# Altium project WaterSupplyController.PrjPcb
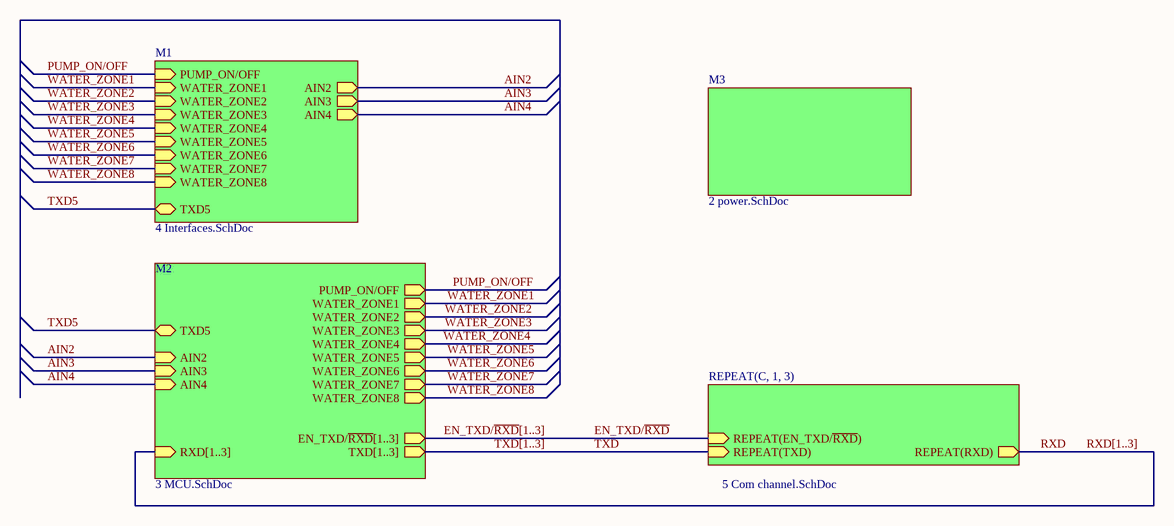
[diagram p0: 1 top level sheet.SchDoc]
GlobalOrganizationName: Элсидан; GlobalProjectName: Контроллер водоснабжения; GlobalProjectNumber: 123456.123; GlobalProjectRevision: 1; PCB_ID: 2022
5 sheets, 176 parts. Net scope: hierarchical (ports join the sheet entries above them; power ports are global).
Board file: WaterSupplyController.PcbDoc
Sheets:
  1 top level sheet.SchDoc
    M3 = 2 power.SchDoc
    M1 = 4 Interfaces.SchDoc
    M2 = 3 MCU.SchDoc
    C1 = 5 Com channel.SchDoc
    C2 = 5 Com channel.SchDoc
    C3 = 5 Com channel.SchDoc

## Sheet 1 top level sheet.SchDoc
size A3; Organization: Altium Limited; Address1: L3, 12a Rodborough Rd; Address2: Frenchs Forest; Address3: NSW; Address4: Australia 2086; DocumentNumber: 1; SheetNumber: 1; SheetTotal: 5

### Sub-sheets
M1 = 4 Interfaces.SchDoc: WATER_ZONE3 (in), WATER_ZONE1 (in), WATER_ZONE2 (in), AIN3 (out), WATER_ZONE5 (in), AIN2 (out), WATER_ZONE8 (in), WATER_ZONE7 (in), AIN4 (out), WATER_ZONE6 (in), PUMP_ON/OFF (in), WATER_ZONE4 (in), TXD5 (bidir)
M2 = 3 MCU.SchDoc: PUMP_ON/OFF (out), WATER_ZONE1 (out), WATER_ZONE2 (out), WATER_ZONE3 (out), WATER_ZONE4 (out), WATER_ZONE5 (out), RXD[1..3] (in), TXD[1..3] (out), EN_TXD/~{RXD}[1..3] (out), WATER_ZONE8 (out), WATER_ZONE6 (out), WATER_ZONE7 (out), AIN3 (in), AIN2 (in), TXD5 (bidir), AIN4 (in)
M3 = 2 power.SchDoc: no entries
REPEAT(C, 1, 3) = 5 Com channel.SchDoc: REPEAT(RXD) (out), REPEAT(TXD) (in), REPEAT(EN_TXD/~{RXD}) (in)

### Nets
AIN2: sheet M1/AIN2, sheet M2/AIN2
AIN3: sheet M1/AIN3, sheet M2/AIN3
AIN4: sheet M1/AIN4, sheet M2/AIN4
EN_TXD/~{RXD}: sheet REPEAT(C, 1, 3)/REPEAT(EN_TXD/~{RXD})
PUMP_ON/OFF: sheet M1/PUMP_ON/OFF, sheet M2/PUMP_ON/OFF
RXD: sheet REPEAT(C, 1, 3)/REPEAT(RXD)
TXD: sheet REPEAT(C, 1, 3)/REPEAT(TXD)
TXD5: sheet M1/TXD5, sheet M2/TXD5
WATER_ZONE1: sheet M1/WATER_ZONE1, sheet M2/WATER_ZONE1
WATER_ZONE2: sheet M1/WATER_ZONE2, sheet M2/WATER_ZONE2
WATER_ZONE3: sheet M1/WATER_ZONE3, sheet M2/WATER_ZONE3
WATER_ZONE4: sheet M1/WATER_ZONE4, sheet M2/WATER_ZONE4
WATER_ZONE5: sheet M1/WATER_ZONE5, sheet M2/WATER_ZONE5
WATER_ZONE6: sheet M1/WATER_ZONE6, sheet M2/WATER_ZONE6
WATER_ZONE7: sheet M1/WATER_ZONE7, sheet M2/WATER_ZONE7
WATER_ZONE8: sheet M1/WATER_ZONE8, sheet M2/WATER_ZONE8

### Buses and harness runs
bus EN_TXD/~{RXD}[1..3] = sheet M2/EN_TXD/~{RXD}[1..3]
bus RXD[1..3] = sheet M2/RXD[1..3]
bus TXD[1..3] = sheet M2/TXD[1..3]

### Notes on the sheet
- Title
- Size:
- Date:
- A3
- Number:
- Time:
- Revision:
- Sheet
- of
- File:

## Sheet 2 power.SchDoc: =GlobalProjectName
size A4; CompanyName: Элсидан; Organization: Элсидан; DocumentNumber: 2; Revision: 1; SheetNumber: 2; SheetTotal: 5; PageSetup: Record=PageOptions|CenterHorizontal=True|CenterVertical=True|PrintScale=1.00|XCorrection=1.00|YCorrection=1.00|PrintKind=1|BorderSize=5000000|LeftOffset=0|BottomOffset=0|Orientation=2|PaperLength=1000|PaperWidth=1000|Scale=100|PaperSource=15|PrintQuality=1200|MediaType=1|DitherType=10|PaperKind=A3|PrintScaleMode=1; Weight: -; ScaleFactor: -; FirstApplication: 123456.123
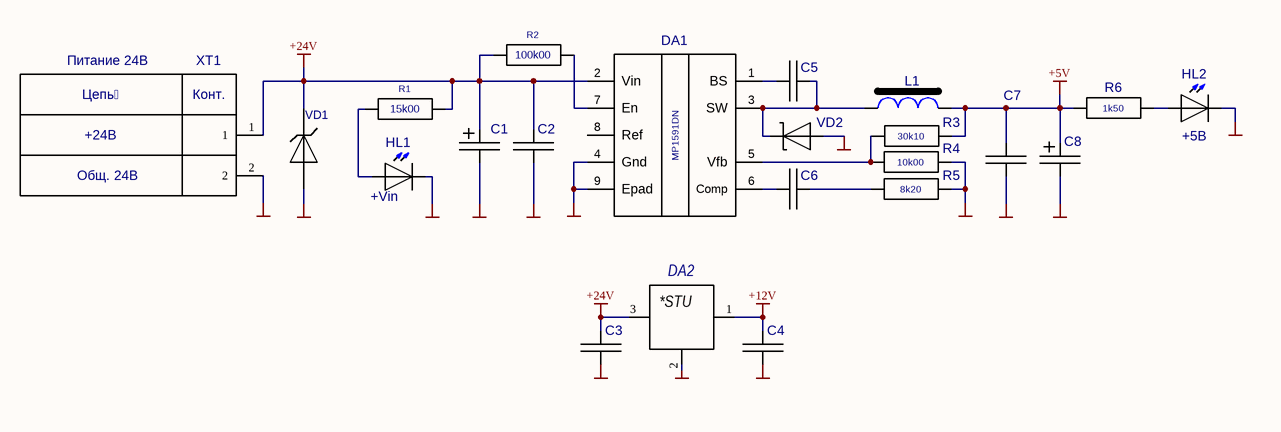
[diagram p1: 2 power.SchDoc]

### Parts
C1  22.0x35V  [TC7343-D]  (value not drawn)
C2  C0603  [0603_CAP]  (value not drawn)
C3  C0603  [0603_CAP]  (value not drawn)
C4  C0603  [0603_CAP]  (value not drawn)
C5  C0603  [0603_CAP]  (value not drawn)
C6  C0603  [0603_CAP]  (value not drawn)
C7  C0603  [0603_CAP]  (value not drawn)
C8  100.0x16V  [TC7343-D]  (value not drawn)
DA1  MP1591DN  [HSOP8]
DA2  L78L12ABUTR  [SOT-89]  (value not drawn)
HL1  KP-2012SYC  [KP-2012_YEL]  (value not drawn)
HL2  KP-2012MGC  [KP-2012_GRN]  (value not drawn)
L1  22µH CDRH124NP-220MC  [CDRH124]  (value not drawn)
R1  15k00  [0603_RES]
R2  100k00  [0603_RES]
R3  value 30k10  [0603_RES]  (hidden comment: R0603)
R4  value 10k00  [0603_RES]  (hidden comment: R0603)
R5  value 8k20  [0603_RES]  (hidden comment: R0603)
R6  value 1k50  [0603_RES]  (hidden comment: R0603)
VD1  P1.5KE24A  [DO-201AD]  (value not drawn)
VD2  STPS3L60U  [SMB-STPS3L60U]  (value not drawn)
XT1  XY301VA-5.0-2P-12  [301-021-12]  (value not drawn)  (parts A,B of 2)

### Nets
+5V: C7.1 C8.1 L1.2 R3.2 R6.1
+12V: C4.1 DA2.1(Out)
+24V: C1.1 C2.1 C3.1 DA1.2(Vin) DA2.3(In) R1.2 R2.1 VD1.2(C) XT1.1
GND: C1.2 C2.2 C3.2 C4.2 C7.2 C8.2 DA1.4(Gnd) DA1.9(Epad) DA2.2(GND) HL1.2(K) HL2.2(K) R4.2 R5.2 VD1.1(A) VD2.1(A) XT1.2
NetC5_1: C5.1 DA1.1(BS)
NetC5_2: C5.2 DA1.3(SW) L1.1 VD2.2(K)
NetC6_1: C6.1 DA1.6(Comp)
NetC6_2: C6.2 R5.1
NetDA1_5: DA1.5(Vfb) R3.1 R4.1
NetDA1_7: DA1.7(En) R2.2
NetHL1_1: HL1.1(A) R1.1
NetHL2_1: HL2.1(A) R6.2

Not connected (* = marked no-connect by the designer): DA1 8(Ref)

### Notes on the sheet
- Питание 24В
- XT1
- +24B
- Цепь
- (near XT1) Конт.
- (near HL2) +5В
- Общ. 24B
- (near HL1) +Vin
- Title
- Size:
- Date:
- A4
- Number:
- Time:
- Revision:
- Sheet
- of
- File:
- (in symbol L78L12ABUTR) *STU

### Library data of the parts
C1 = TC6032-D: Value: 22.0x35V
C2-C4 C7 = C0603: Value: µ10x50V X7R
C5 = C0603: Value: 10nFx50V X7R
C6 = C0603: Value: 1n8x50V X7R
C8 = TC7343-D: Value: 100.0x16V
DA2 = L78L12ABUTR: ID: 19; Input Voltage: +8.5…30V; Output Current: 100mA; Output Voltage: +12V; RMS Noise: 40uV; Temperature Stability: ±4%; Line Regulation: 200mV; Value: L78L12ABUTR; Published: 13.08.2015; Publisher: Andrew Danich; Type: Микросхема; Part Number: L78L12ABUTR
HL1 HL2 = KP-2012
  HL1: Value: KP-2012SYC
  HL2: Value: KP-2012MGC
L1 = CDRH124: Value: 22µH CDRH124NP-220MC
R1 R2 = R0603
  R1: Value: 15k00
  R2: Value: 100k00
VD1 = P1.5KE_X_(A): Value: P1.5KE24A
XT1 = 301-021-12: Клеммник винтовой, 2-контактный, 5мм, прямой; Value: XY301VA-5.0-2P-12
DA1 = MP1591DN: Value: MP1591DN
VD2 = STPS3L60U: Value: STPS3L60U

## Sheet 4 Interfaces.SchDoc
size A3 portrait; Organization: Altium Limited; Address1: L3, 12a Rodborough Rd; Address2: Frenchs Forest; Address3: NSW; Address4: Australia 2086; DocumentNumber: 4; SheetNumber: 4; SheetTotal: 5; PageSetup: Record=PageOptions|CenterHorizontal=True|CenterVertical=True|PrintScale=1.00|XCorrection=1.00|YCorrection=1.00|PrintKind=1|BorderSize=5000000|LeftOffset=0|BottomOffset=0|Orientation=2|PaperLength=1000|PaperWidth=1000|Scale=100|PaperSource=15|PrintQuality=1200|MediaType=1|DitherType=10|PaperKind=A3|PrintScaleMode=1; Weight: -; ScaleFactor: -; NormInspection: Норм.Контр.; FirstApplication: 123456.123
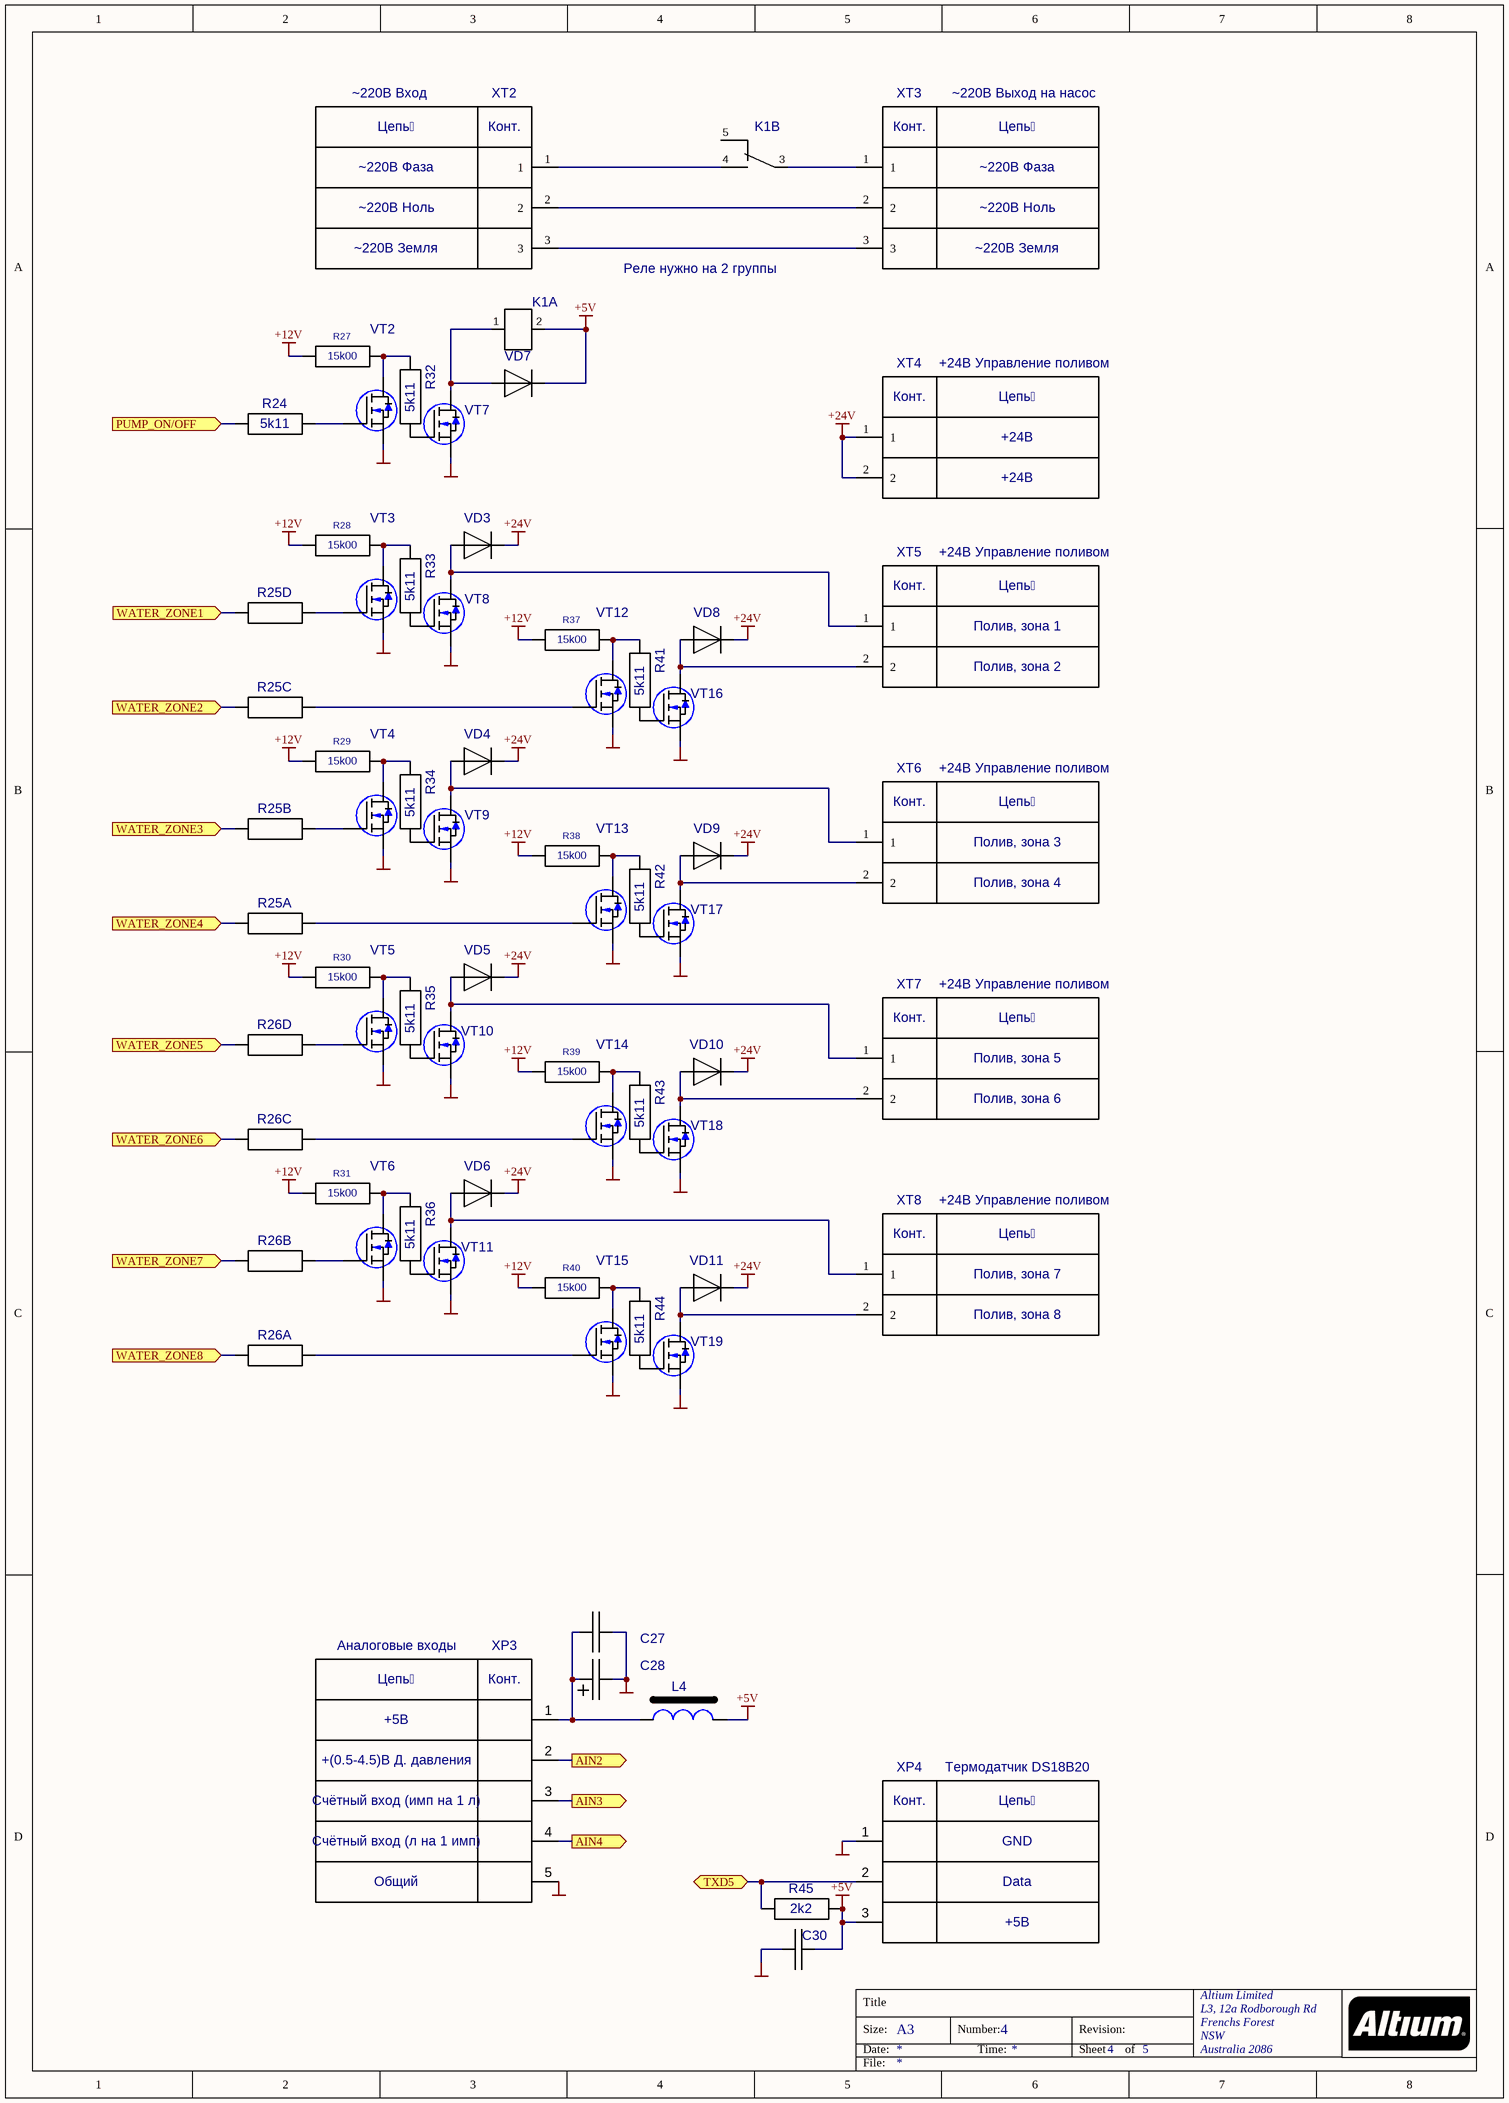
[diagram p2: 4 Interfaces.SchDoc]

### Parts
C27  C0402  [0402_CAP]  (value not drawn)
C28  10.0x16V  [TC3216-A]  (value not drawn)
C30  C0402  [0402_CAP]  (value not drawn)
K1  TRV-5VDC-SC-CD  [TRV-5VDC-SC-CD]  (value not drawn)  (parts A,B of 2)
L4  100µH LQH43CN101K  [LQH43]  (value not drawn)
R24  5k11  [0603_RES]
R25  4k7 CAT16-472J4  [CAT16]  (value not drawn)  (parts A,B,C,D of 4)
R26  4k7 CAT16-472J4  [CAT16]  (value not drawn)  (parts A,B,C,D of 4)
R27  15k00  [0603_RES]
R28  15k00  [0603_RES]
R29  15k00  [0603_RES]
R30  15k00  [0603_RES]
R31  15k00  [0603_RES]
R32  5k11  [0603_RES]
R33  5k11  [0603_RES]
R34  5k11  [0603_RES]
R35  5k11  [0603_RES]
R36  5k11  [0603_RES]
R37  15k00  [0603_RES]
R38  15k00  [0603_RES]
R39  15k00  [0603_RES]
R40  15k00  [0603_RES]
R41  5k11  [0603_RES]
R42  5k11  [0603_RES]
R43  5k11  [0603_RES]
R44  5k11  [0603_RES]
R45  2k2  [0603_RES]
VD3  ES1D  [SMA]  (value not drawn)
VD4  ES1D  [SMA]  (value not drawn)
VD5  ES1D  [SMA]  (value not drawn)
VD6  ES1D  [SMA]  (value not drawn)
VD7  ES1D  [SMA]  (value not drawn)
VD8  ES1D  [SMA]  (value not drawn)
VD9  ES1D  [SMA]  (value not drawn)
VD10  ES1D  [SMA]  (value not drawn)
VD11  ES1D  [SMA]  (value not drawn)
VT2  MMBF170Q-7-F  [SOT-23 MOSFET]  (value not drawn)
VT3  MMBF170Q-7-F  [SOT-23 MOSFET]  (value not drawn)
VT4  MMBF170Q-7-F  [SOT-23 MOSFET]  (value not drawn)
VT5  MMBF170Q-7-F  [SOT-23 MOSFET]  (value not drawn)
VT6  MMBF170Q-7-F  [SOT-23 MOSFET]  (value not drawn)
VT7  AO3400A  [SOT-23 MOSFET]  (value not drawn)
VT8  AO3400A  [SOT-23 MOSFET]  (value not drawn)
VT9  AO3400A  [SOT-23 MOSFET]  (value not drawn)
VT10  AO3400A  [SOT-23 MOSFET]  (value not drawn)
VT11  AO3400A  [SOT-23 MOSFET]  (value not drawn)
VT12  MMBF170Q-7-F  [SOT-23 MOSFET]  (value not drawn)
VT13  MMBF170Q-7-F  [SOT-23 MOSFET]  (value not drawn)
VT14  MMBF170Q-7-F  [SOT-23 MOSFET]  (value not drawn)
VT15  MMBF170Q-7-F  [SOT-23 MOSFET]  (value not drawn)
VT16  AO3400A  [SOT-23 MOSFET]  (value not drawn)
VT17  AO3400A  [SOT-23 MOSFET]  (value not drawn)
VT18  AO3400A  [SOT-23 MOSFET]  (value not drawn)
VT19  AO3400A  [SOT-23 MOSFET]  (value not drawn)
XP3  PH-5  [PH-5]  (value not drawn)  (parts A,B,C,D,E of 5)
XP4  PH-3  [PH-3]  (value not drawn)  (parts A,B,C of 3)
XT2  XY301VA-5.0-3P-12  [301-031-12]  (value not drawn)  (parts A,B,C of 3)
XT3  XY301VA-5.0-3P-12  [301-031-12]  (value not drawn)  (parts A,B,C of 3)
XT4  XY301VA-5.0-2P-12  [301-021-12]  (value not drawn)  (parts A,B of 2)
XT5  XY301VA-5.0-2P-12  [301-021-12]  (value not drawn)  (parts A,B of 2)
XT6  XY301VA-5.0-2P-12  [301-021-12]  (value not drawn)  (parts A,B of 2)
XT7  XY301VA-5.0-2P-12  [301-021-12]  (value not drawn)  (parts A,B of 2)
XT8  XY301VA-5.0-2P-12  [301-021-12]  (value not drawn)  (parts A,B of 2)

### Ports
AIN2 (out), AIN3 (out), AIN4 (out), PUMP_ON/OFF (in), TXD5 (bidir), WATER_ZONE1 (in), WATER_ZONE2 (in), WATER_ZONE3 (in), WATER_ZONE4 (in), WATER_ZONE5 (in), WATER_ZONE6 (in), WATER_ZONE7 (in), WATER_ZONE8 (in)

### Nets
+5V: C30.1 K1.2 L4.2 R45.2 VD7.2(K) XP4.3
+12V: R27.1 R28.1 R29.1 R30.1 R31.1 R37.1 R38.1 R39.1 R40.1
+24V: VD3.2(K) VD4.2(K) VD5.2(K) VD6.2(K) VD8.2(K) VD9.2(K) VD10.2(K) VD11.2(K) XT4.1 XT4.2
GND: C27.2 C28.2 C30.2 VT2.2(S) VT3.2(S) VT4.2(S) VT5.2(S) VT6.2(S) VT7.2(S) VT8.2(S) VT9.2(S) VT10.2(S) VT11.2(S) VT12.2(S) VT13.2(S) VT14.2(S) VT15.2(S) VT16.2(S) VT17.2(S) VT18.2(S) VT19.2(S) XP3.5 XP4.1
AIN2: XP3.2 ; port AIN2
AIN3: XP3.3 ; port AIN3
AIN4: XP3.4 ; port AIN4
PUMP_ON/OFF: R24.1 ; port PUMP_ON/OFF
TXD5: R45.1 XP4.2 ; port TXD5
WATER_ZONE1: R25.7 ; port WATER_ZONE1
WATER_ZONE2: R25.5 ; port WATER_ZONE2
WATER_ZONE3: R25.3 ; port WATER_ZONE3
WATER_ZONE4: R25.1 ; port WATER_ZONE4
WATER_ZONE5: R26.7 ; port WATER_ZONE5
WATER_ZONE6: R26.5 ; port WATER_ZONE6
WATER_ZONE7: R26.3 ; port WATER_ZONE7
WATER_ZONE8: R26.1 ; port WATER_ZONE8
NetC27_1: C27.1 C28.1 L4.1 XP3.1
NetK1_1: K1.1 VD7.1(A) VT7.3(D)
NetK1_3: K1.3 XT3.1
NetK1_4: K1.4 XT2.1
NetR24_2: R24.2 VT2.1(G)
NetR25_2: R25.2 VT13.1(G)
NetR25_4: R25.4 VT4.1(G)
NetR25_6: R25.6 VT12.1(G)
NetR25_8: R25.8 VT3.1(G)
NetR26_2: R26.2 VT15.1(G)
NetR26_4: R26.4 VT6.1(G)
NetR26_6: R26.6 VT14.1(G)
NetR26_8: R26.8 VT5.1(G)
NetR27_2: R27.2 R32.2 VT2.3(D)
NetR28_2: R28.2 R33.2 VT3.3(D)
NetR29_2: R29.2 R34.2 VT4.3(D)
NetR30_2: R30.2 R35.2 VT5.3(D)
NetR31_2: R31.2 R36.2 VT6.3(D)
NetR32_1: R32.1 VT7.1(G)
NetR33_1: R33.1 VT8.1(G)
NetR34_1: R34.1 VT9.1(G)
NetR35_1: R35.1 VT10.1(G)
NetR36_1: R36.1 VT11.1(G)
NetR37_2: R37.2 R41.2 VT12.3(D)
NetR38_2: R38.2 R42.2 VT13.3(D)
NetR39_2: R39.2 R43.2 VT14.3(D)
NetR40_2: R40.2 R44.2 VT15.3(D)
NetR41_1: R41.1 VT16.1(G)
NetR42_1: R42.1 VT17.1(G)
NetR43_1: R43.1 VT18.1(G)
NetR44_1: R44.1 VT19.1(G)
NetVD3_1: VD3.1(A) VT8.3(D) XT5.1
NetVD4_1: VD4.1(A) VT9.3(D) XT6.1
NetVD5_1: VD5.1(A) VT10.3(D) XT7.1
NetVD6_1: VD6.1(A) VT11.3(D) XT8.1
NetVD8_1: VD8.1(A) VT16.3(D) XT5.2
NetVD9_1: VD9.1(A) VT17.3(D) XT6.2
NetVD10_1: VD10.1(A) VT18.3(D) XT7.2
NetVD11_1: VD11.1(A) VT19.3(D) XT8.2
NetXT2_2: XT2.2 XT3.2
NetXT2_3: XT2.3 XT3.3

Not connected (* = marked no-connect by the designer): K1 5

### Notes on the sheet
- ~220В Вход
- XT2
- XT3
- ~220В Выход на насос
- ~220В Фаза
- Цепь
- (near XT2) Конт.
- (near XT3) Конт.
- ~220В Ноль
- ~220В Земля
- Реле нужно на 2 группы
- XT4
- +24В Управление поливом
- (near XT4) Конт.
- +24В
- XT5
- (near XT5) Конт.
- Полив, зона 1
- Полив, зона 2
- XT6
- (near XT6) Конт.
- Полив, зона 3
- Полив, зона 4
- (near XT7) Конт.
- XT7
- Полив, зона 5
- Полив, зона 6
- (near XT8) Конт.
- XT8
- Полив, зона 7
- Полив, зона 8
- Аналоговые входы
- XP3
- +5В
- (near XP3) Конт.
- +(0.5-4.5)В Д. давления
- XP4
- Термодатчик DS18B20
- (near XP3) Счётный вход (л на 1 имп)
- (near XP3) Счётный вход (имп на 1 л)
- (near XP4) Конт.
- GND
- Общий
- Data
- +5B
- Title
- Size:
- Date:
- A3
- Number:
- Time:
- Revision:
- Sheet
- of
- File:

### Library data of the parts
C27 C30 = C0402: Value: µ10x10V X7R
C28 = TC3216-A: Value: 10.0x16V
L4 = LQH43: LQH43, 1812; Value: 100µH LQH43CN101K
R24 R27-R45 = R0603
  R24 R32-R36 R41-R44: Value: 5k11
  R27-R31 R37-R40: Value: 15k00
  R45: Value: 2k2
R25 R26 = CAT16: CAT16-472J4; Value: 4k7 CAT16-472J4
VT2-VT6 VT12-VT15 = MMBF170: Value: MMBF170Q-7-F
VT7-VT11 VT16-VT19 = IRLML2060TRPBF: Value: AO3400A
XP3 = PH-5: Value: B5B-PH-K-S(LF)(SN)
XP4 = PH-3: Value: B3B-PH-K-S(LF)(SN)
XT2 XT3 = 301-031-12: Клеммник винтовой, 3-контактный, 5мм, прямой; Value: XY301VA-5.0-3P-12
XT4-XT8 = 301-021-12: as XT1 on sheet 2 power; Value: XY301VA-5.0-2P-12
K1 = TRV-5VDC-SC-CD: Value: TRV-5VDC-SC-CD
VD3-VD11 = ES1D: Value: ES1D

## Sheet 3 MCU.SchDoc
size A3 portrait; DocumentNumber: 3; SheetNumber: 3; SheetTotal: 5; PageSetup: Record=PageOptions|CenterHorizontal=True|CenterVertical=True|PrintScale=1.00|XCorrection=1.00|YCorrection=1.00|PrintKind=1|BorderSize=5000000|LeftOffset=0|BottomOffset=0|Orientation=2|PaperLength=1000|PaperWidth=1000|Scale=100|PaperSource=15|PrintQuality=1200|MediaType=1|DitherType=10|PaperKind=A3|PrintScaleMode=1; Weight: -; ScaleFactor: -; NormInspection: Норм.Контр.; FirstApplication: 123456.123; DocumentName: Sheet1.SCHDOC
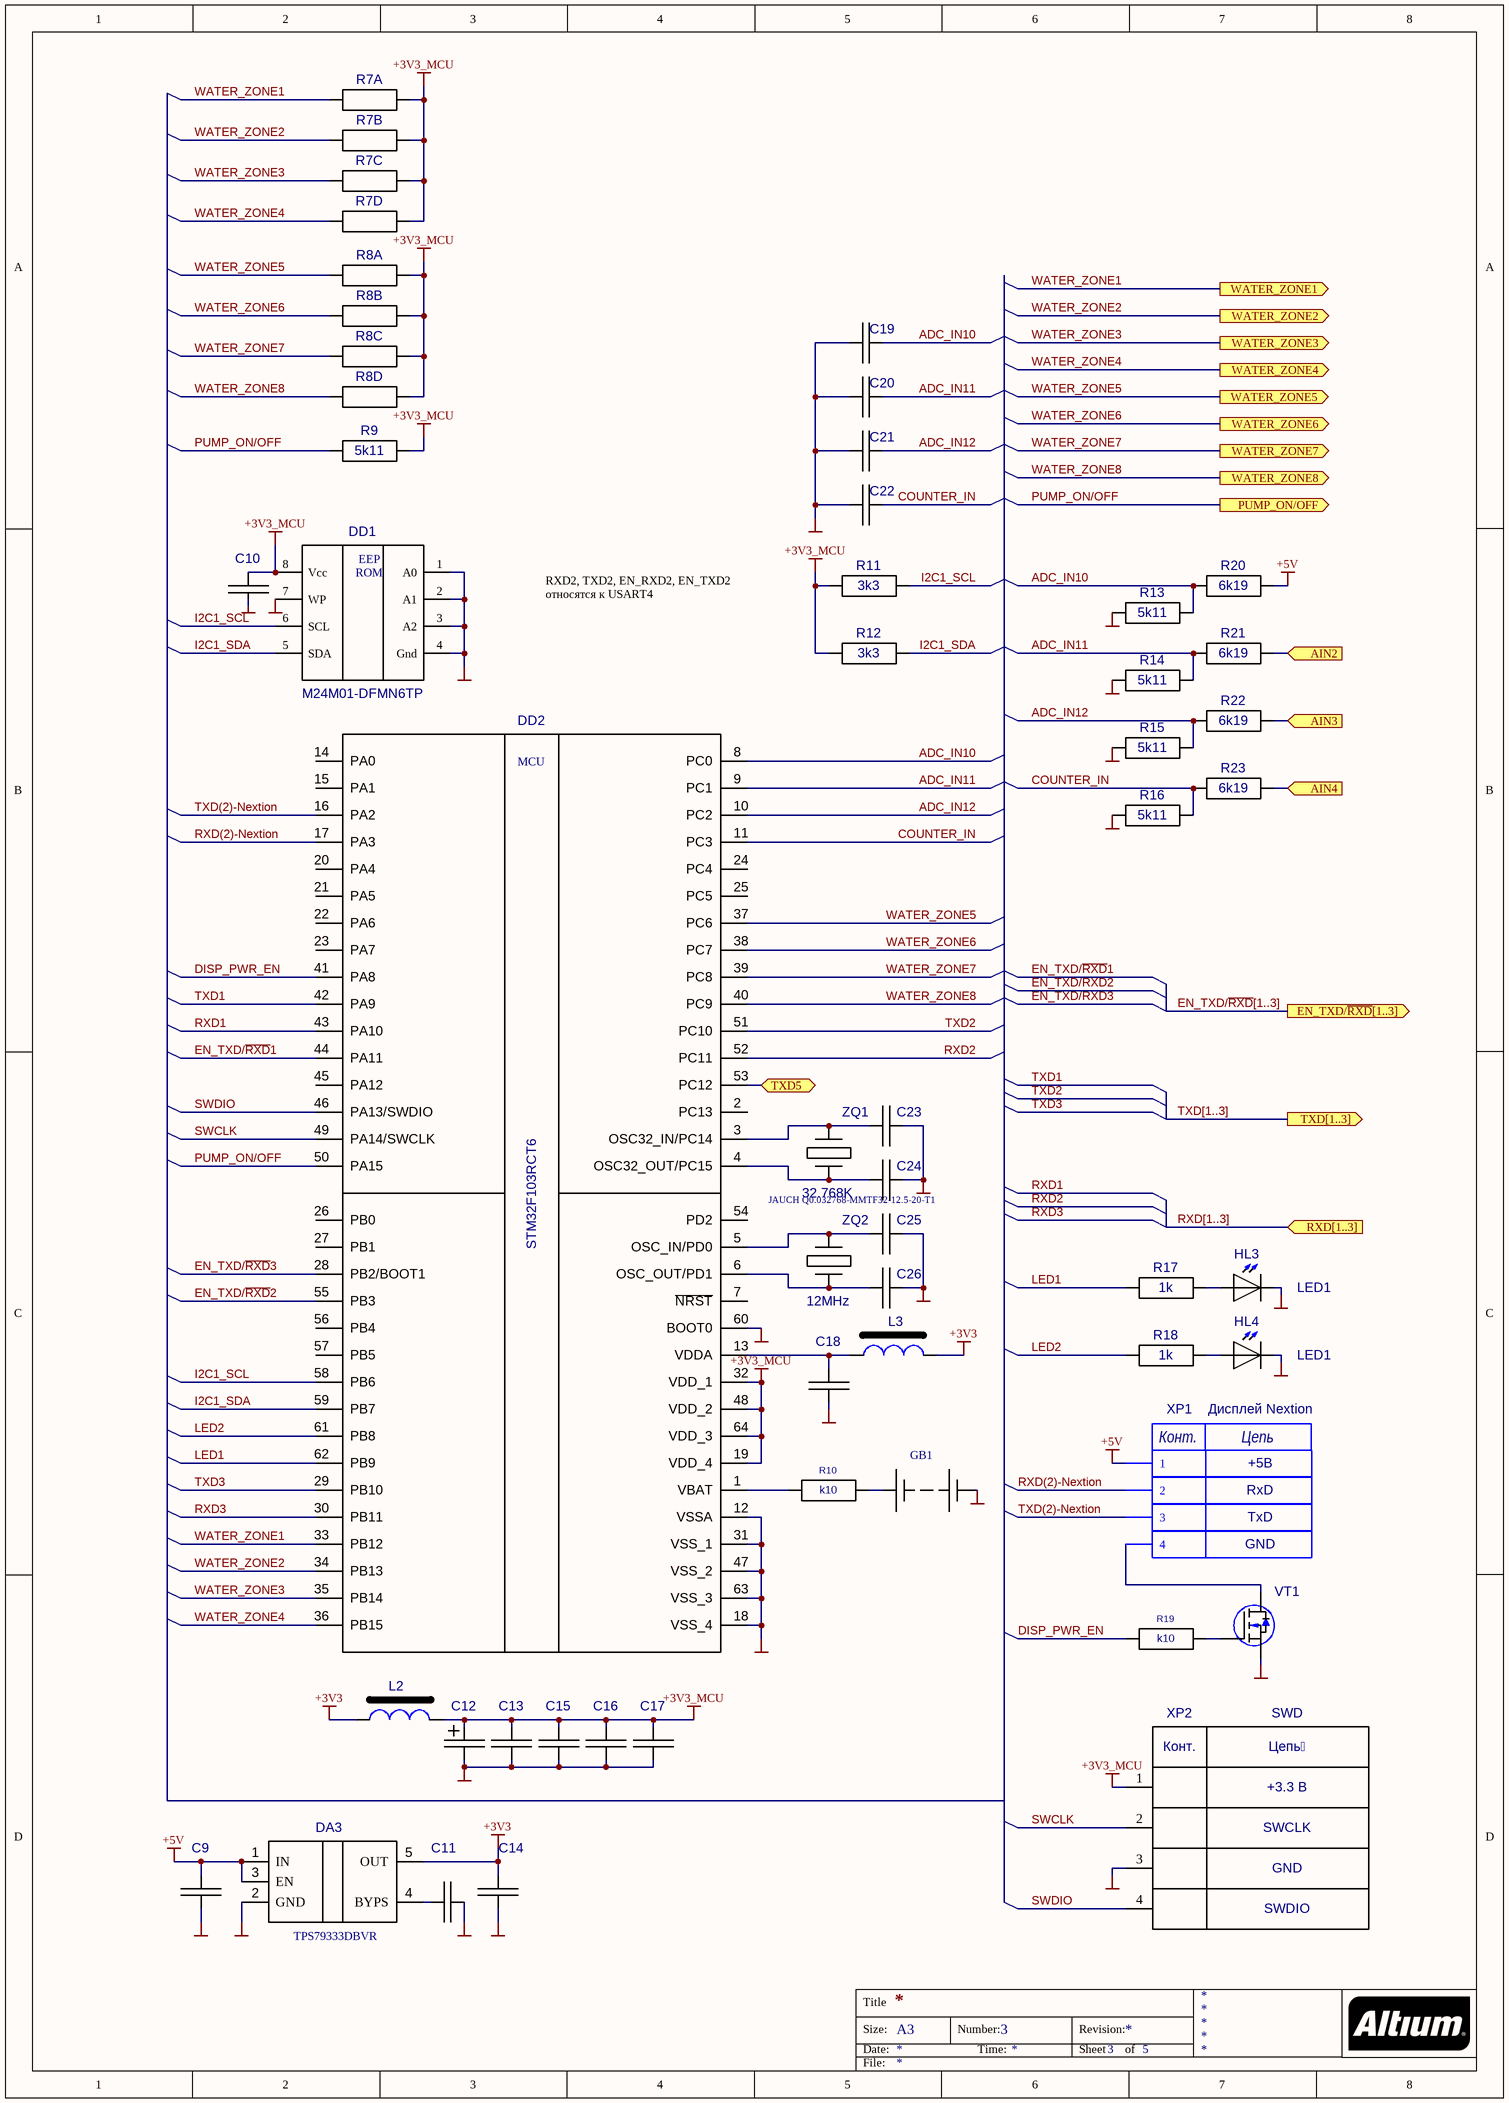
[diagram p3: 3 MCU.SchDoc]

### Parts
?  Con-GOST-Cap  (value not drawn)  (graphical)
C9  C0603  [0603_CAP]  (value not drawn)
C10  C0402  [0402_CAP]  (value not drawn)
C11  C0603  [0603_CAP]  (value not drawn)
C12  220.0x6.3V  [TC6032-C]  (value not drawn)
C13  C0402  [0402_CAP]  (value not drawn)
C14  C0603  [0603_CAP]  (value not drawn)
C15  C0402  [0402_CAP]  (value not drawn)
C16  C0402  [0402_CAP]  (value not drawn)
C17  C0402  [0402_CAP]  (value not drawn)
C18  C0402  [0402_CAP]  (value not drawn)
C19  C0603  [0603_CAP]  (value not drawn)
C20  C0603  [0603_CAP]  (value not drawn)
C21  C0603  [0603_CAP]  (value not drawn)
C22  C0603  [0603_CAP]  (value not drawn)
C23  18pF  [0603_CAP]  (value not drawn)
C24  18pF  [0603_CAP]  (value not drawn)
C25  22pF  [0603_CAP]  (value not drawn)
C26  22pF  [0603_CAP]  (value not drawn)
DA3  TPS79333DBVR  [SOT23-5]
DD1  M24M01-DFMN6TP  [SO8]
DD2  STM32F103RCT6  [LQFP64]
GB1  KLS5-CR2032-03 + Battery CR2032  [CR2032P]  (value not drawn)
HL3  KP-2012SYC  [KP-2012_YEL]  (value not drawn)
HL4  KP-2012SYC  [KP-2012_YEL]  (value not drawn)
L2  BLM18PG  [0603_BLM18]  (value not drawn)
L3  BLM18PG  [0603_BLM18]  (value not drawn)
R7  4k7 CAT16-472J4  [CAT16]  (value not drawn)  (parts A,B,C,D of 4)
R8  4k7 CAT16-472J4  [CAT16]  (value not drawn)  (parts A,B,C,D of 4)
R9  5k11  [0603_RES]
R10  k10  [0603_RES]
R11  value 3k3  [0603_RES]  (hidden comment: R0603)
R12  value 3k3  [0603_RES]  (hidden comment: R0603)
R13  value 5k11  [0603_RES]  (hidden comment: R0603)
R14  value 5k11  [0603_RES]  (hidden comment: R0603)
R15  value 5k11  [0603_RES]  (hidden comment: R0603)
R16  value 5k11  [0603_RES]  (hidden comment: R0603)
R17  value 1k  [0603_RES]  (hidden comment: R0603)
R18  value 1k  [0603_RES]  (hidden comment: R0603)
R19  k10  [0603_RES]
R20  value 6k19  [0603_RES]  (hidden comment: R0603)
R21  value 6k19  [0603_RES]  (hidden comment: R0603)
R22  value 6k19  [0603_RES]  (hidden comment: R0603)
R23  value 6k19  [0603_RES]  (hidden comment: R0603)
VT1  MMBF170Q-7-F  [SOT-23 MOSFET]  (value not drawn)
XP1  DS1022-1*4RDF11-B  [PLS-4RR]  (value not drawn)  (parts A,B,C,D of 4)
XP2  PLD2-6  [PLD2-6]  (value not drawn)  (parts A,B,C,D of 6)
ZQ1  value 32.768K  [1206_NX3215SA]  (hidden comment: NX3215SA-32.768K-STD-MUA-8)
ZQ2  12MHz  [HC49SM]

### Ports
AIN2 (in), AIN3 (in), AIN4 (in), EN_TXD/~{RXD}[1..3] (out), PUMP_ON/OFF (out), RXD[1..3] (in), TXD5 (bidir), TXD[1..3] (out), WATER_ZONE1 (out), WATER_ZONE2 (out), WATER_ZONE3 (out), WATER_ZONE4 (out), WATER_ZONE5 (out), WATER_ZONE6 (out), WATER_ZONE7 (out), WATER_ZONE8 (out)

### Nets
+3V3: C14.1 DA3.5(OUT) L2.1 L3.1
+3V3_MCU: C10.1 C12.1 C13.1 C15.1 C16.1 C17.1 DD1.8(Vcc) DD2.19(VDD_4) DD2.32(VDD_1) DD2.48(VDD_2) DD2.64(VDD_3) L2.2 R7.2 R7.4 R7.6 R7.8 R8.2 R8.4 R8.6 R8.8 R9.2 R11.2 R12.2 XP2.1
+5V: C9.2 DA3.1(IN) DA3.3(EN) R20.1 XP1.1
GND: C9.1 C10.2 C11.2 C12.2 C13.2 C14.2 C15.2 C16.2 C17.2 C18.2 C19.2 C20.2 C21.2 C22.2 C23.2 C24.2 C25.2 C26.2 DA3.2(GND) DD1.1(A0) DD1.2(A1) DD1.3(A2) DD1.4(Gnd) DD1.7(WP) DD2.12(VSSA) DD2.18(VSS_4) DD2.31(VSS_1) DD2.47(VSS_2) DD2.60(BOOT0) DD2.63(VSS_3) GB1.2(-) HL3.2(K) HL4.2(K) R13.2 R14.2 R15.2 R16.2 VT1.2(S) XP2.3
ADC_IN10: C19.1 DD2.8(PC0) R13.1 R20.2  [project net ADC_IN10_3]
ADC_IN11: C20.1 DD2.9(PC1) R14.1 R21.2  [project net ADC_IN11_3]
ADC_IN12: C21.1 DD2.10(PC2) R15.1 R22.2  [project net ADC_IN12_3]
AIN2: R21.1 ; port AIN2
AIN3: R22.1 ; port AIN3
AIN4: R23.1 ; port AIN4
COUNTER_IN: C22.1 DD2.11(PC3) R16.1 R23.2  [project net COUNTER_IN_3]
DISP_PWR_EN: DD2.41(PA8) R19.1  [project net DISP_PWR_EN_3]
EN_TXD/~{RXD}1: DD2.44(PA11)
EN_TXD/~{RXD}2: DD2.55(PB3)
EN_TXD/~{RXD}3: DD2.28(PB2/BOOT1)
I2C1_SCL: DD1.6(SCL) DD2.58(PB6) R11.1  [project net I2C1_SCL_3]
I2C1_SDA: DD1.5(SDA) DD2.59(PB7) R12.1  [project net I2C1_SDA_3]
LED1: DD2.62(PB9) R17.1  [project net LED1_3]
LED2: DD2.61(PB8) R18.1  [project net LED2_3]
PUMP_ON/OFF: DD2.50(PA15) R9.1 ; port PUMP_ON/OFF
RXD1: DD2.43(PA10)
RXD2: DD2.52(PC11)
RXD3: DD2.30(PB11)
RXD(2)-Nextion: DD2.17(PA3) XP1.2  [project net RXD(2)-Nextion_3]
SWCLK: DD2.49(PA14/SWCLK) XP2.2  [project net SWCLK_3]
SWDIO: DD2.46(PA13/SWDIO) XP2.4  [project net SWDIO_3]
TXD1: DD2.42(PA9)
TXD2: DD2.51(PC10)
TXD3: DD2.29(PB10)
TXD5: DD2.53(PC12) ; port TXD5
TXD(2)-Nextion: DD2.16(PA2) XP1.3  [project net TXD(2)-Nextion_3]
WATER_ZONE1: DD2.33(PB12) R7.1 ; port WATER_ZONE1
WATER_ZONE2: DD2.34(PB13) R7.3 ; port WATER_ZONE2
WATER_ZONE3: DD2.35(PB14) R7.5 ; port WATER_ZONE3
WATER_ZONE4: DD2.36(PB15) R7.7 ; port WATER_ZONE4
WATER_ZONE5: DD2.37(PC6) R8.1 ; port WATER_ZONE5
WATER_ZONE6: DD2.38(PC7) R8.3 ; port WATER_ZONE6
WATER_ZONE7: DD2.39(PC8) R8.5 ; port WATER_ZONE7
WATER_ZONE8: DD2.40(PC9) R8.7 ; port WATER_ZONE8
NetC11_1: C11.1 DA3.4(BYPS)
NetC18_1: C18.1 DD2.13(VDDA) L3.2
NetC23_1: C23.1 DD2.3(OSC32_IN/PC14) ZQ1.1
NetC24_1: C24.1 DD2.4(OSC32_OUT/PC15) ZQ1.2
NetC25_1: C25.1 DD2.5(OSC_IN/PD0) ZQ2.2
NetC26_1: C26.1 DD2.6(OSC_OUT/PD1) ZQ2.1
NetDD2_1: DD2.1(VBAT) R10.1
NetGB1_1: GB1.1(+) R10.2
NetHL3_1: HL3.1(A) R17.2
NetHL4_1: HL4.1(A) R18.2
NetR19_2: R19.2 VT1.1(G)
NetVT1_3: VT1.3(D) XP1.4

Not connected (* = marked no-connect by the designer): DD2 2(PC13) 7(~{NRST}) 14(PA0) 15(PA1) 20(PA4) 21(PA5) 22(PA6) 23(PA7) 24(PC4) 25(PC5) 26(PB0) 27(PB1) 45(PA12) 54(PD2) 56(PB4) 57(PB5)

### Buses and harness runs
bus EN_TXD/~{RXD}[1..3] = port EN_TXD/~{RXD}[1..3]
bus RXD[1..3] = port RXD[1..3]
bus TXD[1..3] = port TXD[1..3]

### Notes on the sheet
- RXD2, TXD2, EN_RXD2, EN_TXD2
  относятся к USART4
- JAUCH Q0.032768-MMTF32-12.5-20-T1
- LED1
- XP1
- (near ?) Дисплей Nextion
- TxD
- (near ?) RxD
- (near ?) +5B
- (near VT1) GND
- XP2
- SWD
- (near XP2) Конт.
- +3.3 B
- Цепь
- SWCLK
- SWDIO
- GND
- Title
- Size:
- Date:
- A3
- Number:
- Time:
- Revision:
- Sheet
- of
- File:
- (in symbol AT24C32AN-10SU) EEP; ROM
- (in symbol Connector GOST Cap) Конт.; Цепь
- (in symbol STM32F103RXT) MCU

### Library data of the parts
? = Connector GOST Cap: Шапка разъёма ГОСТ; ID: 65; Connector Type: Male; Surface Finish: Gold; Pitch: 2.54mm; Value: Connector GOST Cap; Published: 08.04.2020; Type: Шапка разъёма ГОСТ; Part Number: Connector GOST Cap
C9 C14 = C0603: Value: 2µ2x10V X7R
C10 C13 C15-C18 = C0402: Value: µ10x10V X7R
C11 C19-C22 = C0603: Value: 10nFx50V X7R
C12 = TC6032-C: Value: 220.0x6.3V
C23 C24 = C0603: Value: 18pFx50V NP0
C25 C26 = C0603: Value: 22pFx50V NP0
DD1 = AT24C32AN-10SU: Two-wire / Serial EEPROM / 32K (4096 x 8); Value: M24M01-DFMN6TP
DD2 = STM32F103RXT: Value: STM32F103RCT6
GB1 = Battery 2032: Voltage: 3V; Part Number: KLS5-CR2032-03 + Battery CR2032; Footprint Patch: connector.pcblib; BOM: CR2032P; ComponentLink1Description: Datasheet; Manufacturer: *; Manufacturer Part Number: *; Category: Battery; Value: KLS5-CR2032-03
HL3 HL4 = KP-2012: Value: KP-2012SYC
L2 L3 = BLM18PG: Value: 470R BLM18PG471SN1D
R7 R8 = CAT16: CAT16-472J4; Value: 4k7 CAT16-472J4
R9 R10 R19 = R0603
  R9: Value: 5k11
  R10 R19: Value: k10
VT1 = MMBF170: Value: MMBF170Q-7-F
XP1 = PLS-4R-Rectan: ID: 70; Limit Voltage: 250V; Limit Current: 3A; Connector Type: Male; Resistance: 15momh; Surface Finish: Gold; Pitch: 2.54mm; Value: DS1022-1*4RDF11-B; Published: 08.04.2020; Type: Краевые контакты печатным способом; Part Number: PLS-4R-Rectan; Pins: 4
XP2 = PLD2-6: Value: DS1025-05-2*3P8BV1-B
ZQ2 = HC49SM: Value: 12MHz HC49SM
DA3 = TPS79333DBVR: Value: TPS79333DBVR

## Sheet 5 Com channel.SchDoc
size A4; Organization: Altium Limited; Address1: L3, 12a Rodborough Rd; Address2: Frenchs Forest; Address3: NSW; Address4: Australia 2086; DocumentNumber: 5; SheetNumber: 5; SheetTotal: 5
Used 3 times, as channels C1, C2, C3. Parts and nets are listed once, with the designators drawn on the sheet.
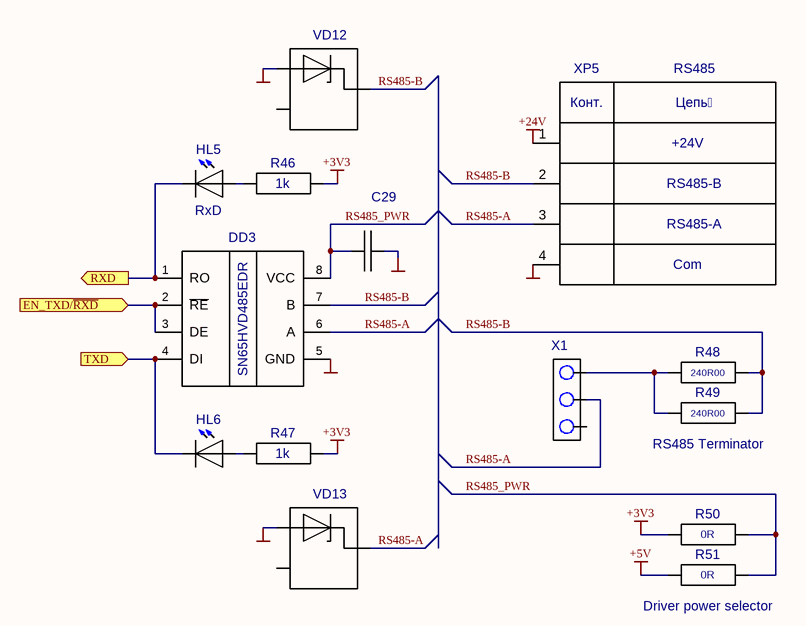
[diagram p4: 5 Com channel.SchDoc]

### Parts
C29  C0402  [0402_CAP]  (value not drawn)
DD3  value SN65HVD485EDR  [SO8]  (hidden comment: ADM485AR)
HL5  KP-2012MGC  [KP-2012_GRN]  (value not drawn)
HL6  KP-2012SYC  [KP-2012_YEL]  (value not drawn)
R46  value 1k  [0603_RES]  (hidden comment: R0603)
R47  value 1k  [0603_RES]  (hidden comment: R0603)
R48  value 240R00  [0805_RES]  (hidden comment: R0805)
R49  value 240R00  [0805_RES]  (hidden comment: R0805)
R50  0R  [0402_RES]
R51  0R  [0402_RES]
VD12  GSOT12-E3-08  [SOT-23-(2)]  (value not drawn)
VD13  GSOT12-E3-08  [SOT-23-(2)]  (value not drawn)
X1  DS1025-01-1*3 P8BV1  [PLS2-3]  (value not drawn)
XP5  PH-4  [PH-4]  (value not drawn)  (parts A,B,C,D of 4)

### Ports
EN_TXD/~{RXD} (in), RXD (out), TXD (in)

### Nets
+3V3: R46.1 R47.1 R50.2
+5V: R51.2
+24V: XP5.1
GND: C29.1 DD3.5(GND) VD12.1 VD13.1 XP5.4
EN_TXD/~{RXD}: DD3.2(~{RE}) DD3.3(DE) ; port EN_TXD/~{RXD}
RS485-A: DD3.6(A) VD13.3 X1.2 XP5.3  [project net RS485-A_5]
RS485-B: DD3.7(B) R48.1 R49.1 VD12.3 XP5.2  [project net RS485-B_5]
RS485_PWR: C29.2 DD3.8(VCC) R50.1 R51.1  [project net RS485_PWR_5]
RXD: DD3.1(RO) HL5.2(K) ; port RXD
TXD: DD3.4(DI) HL6.2(K) ; port TXD
NetHL5_1: HL5.1(A) R46.2
NetHL6_1: HL6.1(A) R47.2
NetR48_2: R48.2 R49.2 X1.1

Not connected (* = marked no-connect by the designer): VD12 2; VD13 2; X1 3

### Channels
C1: designators end in _C1; ports EN_TXD/~{RXD}=EN_TXD/~{RXD}1 RXD=RXD1 TXD=TXD1
C2: designators end in _C2; ports EN_TXD/~{RXD}=EN_TXD/~{RXD}2 RXD=RXD2 TXD=TXD2
C3: designators end in _C3; ports EN_TXD/~{RXD}=EN_TXD/~{RXD}3 RXD=RXD3 TXD=TXD3

### Notes on the sheet
- (near XP5) Конт.
- XP5
- Цепь
- RS485
- +24V
- RS485-B
- (near HL5) RxD
- Com
- RS485-A
- (near R49) RS485 Terminator
- (near R51) Driver power selector
- Title
- Size:
- Date:
- A4
- Number:
- Time:
- Revision:
- Sheet
- of
- File:

### Library data of the parts
C29 = C0402: Value: µ10x10V X7R
HL5 HL6 = KP-2012
  HL5: Value: KP-2012MGC
  HL6: Value: KP-2012SYC
R50 R51 = R0402: Value: 0R
VD12 VD13 = GSOT12C: Single-line ESD protection device / ± 30 kV contact discharge / ± 30 kV air discharge; Value: GSOT12C
X1 = PLS2-3: Value: DS1025-01-1*3 P8BV1
XP5 = PH-4: Value: B4B-PH-K-S(LF)(SN)

## Nets that join several sheets
+3V3: 3 MCU (C14.1 DA3.5 L2.1 L3.1), C1 (R46_C1.1 R47_C1.1 R50_C1.2), C2 (R46_C2.1 R47_C2.1 R50_C2.2), C3 (R46_C3.1 R47_C3.1 R50_C3.2)
+5V: 2 power (5 pins), 4 Interfaces (6 pins), 3 MCU (5 pins), C1 (R51_C1.2), C2 (R51_C2.2), C3 (R51_C3.2)
+12V: 2 power (C4.1 DA2.1), 4 Interfaces (9 pins)
+24V: 2 power (9 pins), 4 Interfaces (10 pins), C1 (XP5_C1.1), C2 (XP5_C2.1), C3 (XP5_C3.1)
GND: 2 power (16 pins), 4 Interfaces (23 pins), 3 MCU (39 pins), C1 (5 pins), C2 (5 pins), C3 (5 pins)
AIN2: 4 Interfaces (XP3.2), 3 MCU (R21.1)
AIN3: 4 Interfaces (XP3.3), 3 MCU (R22.1)
AIN4: 4 Interfaces (XP3.4), 3 MCU (R23.1)
EN_TXD/~{RXD}1: 3 MCU (DD2.44), C1 (DD3_C1.2 DD3_C1.3)
EN_TXD/~{RXD}2: 3 MCU (DD2.55), C2 (DD3_C2.2 DD3_C2.3)
EN_TXD/~{RXD}3: 3 MCU (DD2.28), C3 (DD3_C3.2 DD3_C3.3)
PUMP_ON/OFF: 4 Interfaces (R24.1), 3 MCU (DD2.50 R9.1)
RXD1: 3 MCU (DD2.43), C1 (DD3_C1.1 HL5_C1.2)
RXD2: 3 MCU (DD2.52), C2 (DD3_C2.1 HL5_C2.2)
RXD3: 3 MCU (DD2.30), C3 (DD3_C3.1 HL5_C3.2)
TXD1: 3 MCU (DD2.42), C1 (DD3_C1.4 HL6_C1.2)
TXD2: 3 MCU (DD2.51), C2 (DD3_C2.4 HL6_C2.2)
TXD3: 3 MCU (DD2.29), C3 (DD3_C3.4 HL6_C3.2)
TXD5: 4 Interfaces (R45.1 XP4.2), 3 MCU (DD2.53)
WATER_ZONE1: 4 Interfaces (R25.7), 3 MCU (DD2.33 R7.1)
WATER_ZONE2: 4 Interfaces (R25.5), 3 MCU (DD2.34 R7.3)
WATER_ZONE3: 4 Interfaces (R25.3), 3 MCU (DD2.35 R7.5)
WATER_ZONE4: 4 Interfaces (R25.1), 3 MCU (DD2.36 R7.7)
WATER_ZONE5: 4 Interfaces (R26.7), 3 MCU (DD2.37 R8.1)
WATER_ZONE6: 4 Interfaces (R26.5), 3 MCU (DD2.38 R8.3)
WATER_ZONE7: 4 Interfaces (R26.3), 3 MCU (DD2.39 R8.5)
WATER_ZONE8: 4 Interfaces (R26.1), 3 MCU (DD2.40 R8.7)